# EAGLE schematic SMPS GACUN (EAGLE 9.5.0)
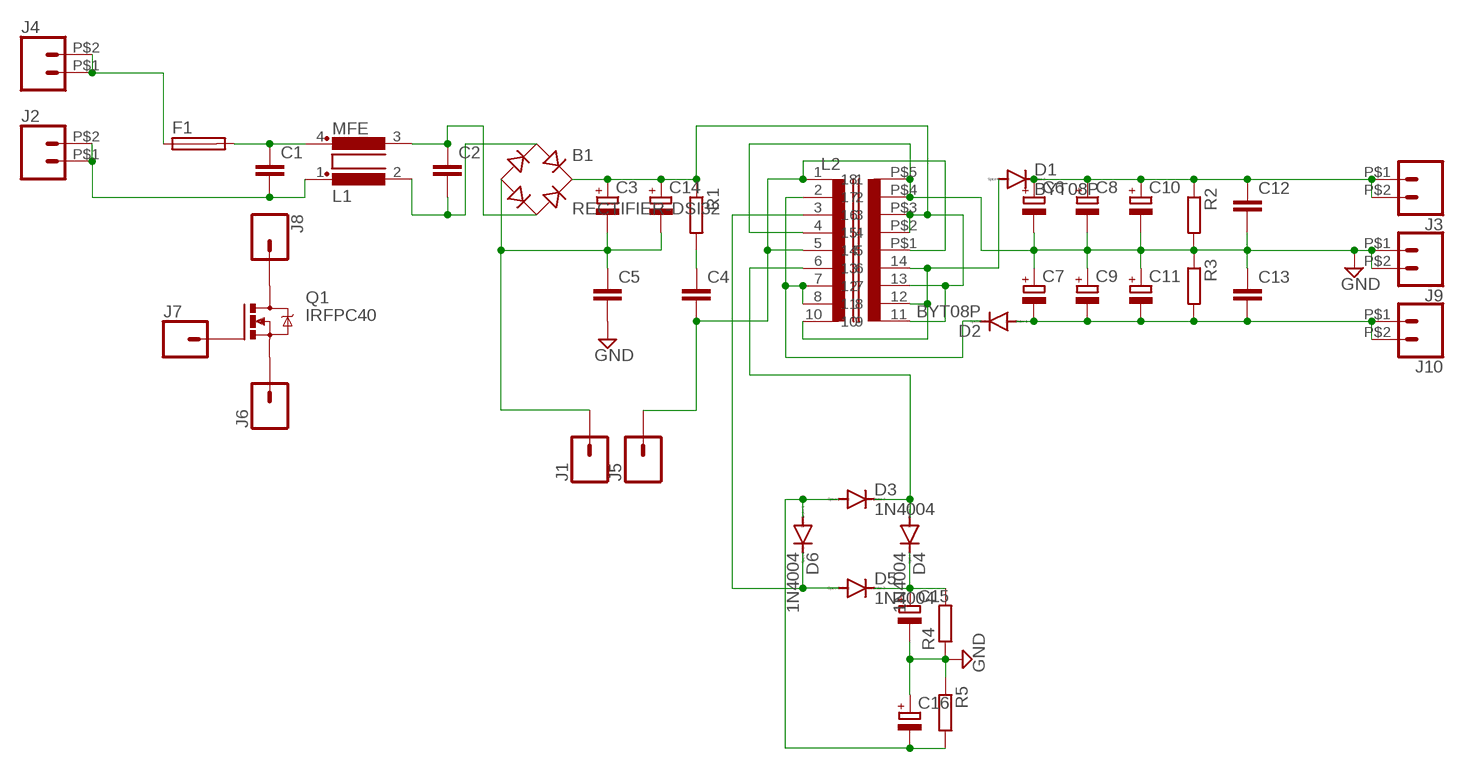
[diagram p0: schematic, sheet 1]

## Parts
B1  RECTIFIER-DSI32  [DSI32]
C1  C-EU225-074X268  [C225-074X268]
C2  C-EU225-074X268  [C225-074X268]
C3  CPOL-EUE10-35  [EB35D]
C4  C-EU050-025X075  [C050-025X075]
C5  C-EU225-074X268  [C225-074X268]
C6  CPOL-EUE7.5-16  [E7,5-16]
C7  CPOL-EUE7.5-16  [E7,5-16]
C8  CPOL-EUE7.5-16  [E7,5-16]
C9  CPOL-EUE7.5-16  [E7,5-16]
C10  CPOL-EUE7.5-16  [E7,5-16]
C11  CPOL-EUE7.5-16  [E7,5-16]
C12  C-EU102-043X133  [C102-043X133]
C13  C-EU102-043X133  [C102-043X133]
C14  CPOL-EUE10-35  [EB35D]
C15  CPOL-EUSANYO_F13  [SANYO-OSCON_F13]
C16  CPOL-EUSANYO_F13  [SANYO-OSCON_F13]
D1  BYT08P  [TO220ACS]
D2  BYT08P  [TO220ACS]
D3  1N4004  [DO41-10]
D4  1N4004  [DO41-10]
D5  1N4004  [DO41-10]
D6  1N4004  [DO41-10]
F1  SH22,5A  [SH22,5A]
J1  CONN_01PTH_LONGPAD  [1X01_LONGPAD]
J2  CONN_02PTH2  [1X02_BIG]
J3  CONN_02PTH2  [1X02_BIG]
J4  CONN_02PTH2  [1X02_BIG]
J5  CONN_01PTH_LONGPAD  [1X01_LONGPAD]
J6  CONN_01PTH_LONGPAD  [1X01_LONGPAD]
J7  CONN_01PTH_LONGPAD  [1X01_LONGPAD]
J8  CONN_01PTH_LONGPAD  [1X01_LONGPAD]
J9  CONN_02PTH2  [1X02_BIG]
J10  CONN_02PTH2  [1X02_BIG]
L1  MFE  [MFE]
L2  ST-D4TV  [ST-D4]
Q1  IRFPC40  [TO247BV]
R1  R-EU_0617/17  [0617/17]
R2  R-EU_0617/17  [0617/17]
R3  R-EU_0617/17  [0617/17]
R4  R-EU_0207/5V  [0207/5V]
R5  R-EU_0207/5V  [0207/5V]

## Nets
GND: C5.2 C6.- C7.+ C8.- C9.+ C10.- C11.+ C12.2 C13.1 C15.- C16.+ J9.P$1 J9.P$2 L2.4 L2.P$4 L2.P$5 R2.2 R3.1 R4.1 R5.1
N$1: C1.1 F1.2 L1.4
N$2: B1.AC2 C2.1 L1.3
N$3: C1.2 J2.P$1 J2.P$2 L1.1
N$4: B1.AC1 C2.2 L1.2
N$5: C4.2 J5.1 L2.1 L2.5 L2.P$1
N$6: B1.- C3.- C5.1 C14.- J1.1
N$7: C4.1 R1.2
N$8: F1.1 J4.P$1 J4.P$2
N$9: J6.1 Q1.S
N$10: C6.+ C8.+ C10.+ C12.1 D1.C J3.P$1 J3.P$2 R2.1
N$11: J7.1 Q1.G
N$13: D2.C L2.2 L2.7 L2.8
N$14: J8.1 Q1.D
N$15: B1.+ C3.+ C14.+ L2.11 L2.13 L2.P$2 L2.P$3 R1.1
N$17: C7.- C9.- C11.- C13.2 D2.A J10.P$1 J10.P$2 R3.2
N$25: D1.A L2.10 L2.12 L2.14
N$35: D5.A D6.C L2.3
N$39: C15.+ D4.C D5.C R4.2
N$40: C16.- D3.A D6.A R5.2
N$41: D3.C D4.A L2.6

## Library data of the parts
B1 = rectifier:RECTIFIER-: Rectifier
C1 C2 C4 C5 C12 C13 = rcl:C-EU: CAPACITOR, European symbol; SPICEPREFIX: C
C3 C6-C11 C14-C16 = rcl:CPOL-EU: POLARIZED CAPACITOR, European symbol; SPICEPREFIX: C
D1 D2 = diode:BYT08P: DIODE ultra fast
D3-D6 = diode:1N4004: DIODE general purpose rectifier, 1 A
F1 = fuse:SH22,5A: FUSE HOLDER grid 22,5mm, isolated cap OGN0031 8201, Schurter (Buerklin); MPN: 0031.7701.11; OC_FARNELL: unknown; OC_NEWARK: 04F1224
J1 J5-J8 = SparkFun-Connectors:CONN_01: Single connection point. Often used as Generic Header-pin footprint for 0.1 inch spaced/style header connections On any of the 0.1 inch spaced packages, you can populate with these: Break Away Headers - Straight <https://www.sparkfun.com/products/116> (PRT-00116) Break Away Male Headers - Right Angle <https://www.sparkfun.com/products/553> (PRT-00553) Female Headers <https://www.sparkfun.com/products/115> (PRT-00115) Break Away Headers - Machine Pin <https://www.sparkfun.com/products/117> (PRT-00117) Break Away Female Headers - Swiss Machine Pin <https://www.sparkfun.com/products/743> (PRT-00743) This device is also useful as a general connection point to wire up your design to another part of your project. Our various solder wires solder well into these plated through hole pads. Hook-Up Wire - Assortment (Stranded, 22 AWG) <https://www.sparkfun.com/products/11375> (PRT-11375) Hook-Up Wire - Assortment (Solid Core, 22 AWG) <https://www.sparkfun.com/products/11367> (PRT-11367) View the entire wire category on our website here <https://www.sparkfun.com/categories/141> Special notes: SMTSO-256-ET is a "flush mount" nut for a 4-40 screw. We mostly use this on specialty testbeds; it is a nice way to connect hardware to your PCB at an adjustable hieght. Also note, the SNAP packages are for using a snappable style connector. We sell a baggie of snaps and they are also used on two LilyPad designs: Snap Assortment - 30 pack (male and female) <https://www.sparkfun.com/products/11347> (DEV-11347) LilyPad Arduino SimpleSnap <https://www.sparkfun.com/products/10941> (DEV-10941) LilyPad SimpleSnap Protoboard <https://www.sparkfun.com/products/10940> (DEV-10940)
J2-J4 J9 J10 = SparkFun-Connectors:CONN_02: Multi connection point. Often used as Generic Header-pin footprint for 0.1 inch spaced/style header connections On any of the 0.1 inch spaced packages, you can populate with these: Break Away Headers - Straight <https://www.sparkfun.com/products/116> (PRT-00116) Break Away Male Headers - Right Angle <https://www.sparkfun.com/products/553> (PRT-00553) Female Headers <https://www.sparkfun.com/products/115> (PRT-00115) Break Away Headers - Machine Pin <https://www.sparkfun.com/products/117> (PRT-00117) Break Away Female Headers - Swiss Machine Pin <https://www.sparkfun.com/products/743> (PRT-00743) For SCREWTERMINALS and SPRING TERMINALS visit here: Screw Terimnals on SparkFun.com <https://www.sparkfun.com/search/results?term=Screw+Terminals> (5mm/3.5mm/2.54mm spacing) This device is also useful as a general connection point to wire up your design to another part of your project. Our various solder wires solder well into these plated through hole pads. Hook-Up Wire - Assortment (Stranded, 22 AWG) <https://www.sparkfun.com/products/11375> (PRT-11375) Hook-Up Wire - Assortment (Solid Core, 22 AWG) <https://www.sparkfun.com/products/11367> (PRT-11367) View the entire wire category on our website here <https://www.sparkfun.com/categories/141> Special notes: Molex polarized connector foot print use with: PRT-08233 with associated crimp pins and housings. 2.54_SCREWTERM for use with PRT-10571. 3.5mm Screw Terminal footprints for PRT-08084 5mm Screw Terminal footprints for use with PRT-08432
L1 = inductors:MFE: FILTER
L2 = trafo-siemens:ST-D4: TRANSFORMER
Q1 = transistor-power:IRFPC40: N-CHANNEL MOS FET
R1-R3 = rcl:R-EU_: RESISTOR, European symbol; SPICEPREFIX: R
R4 R5 = resistor:R-EU_: RESISTOR, European symbol